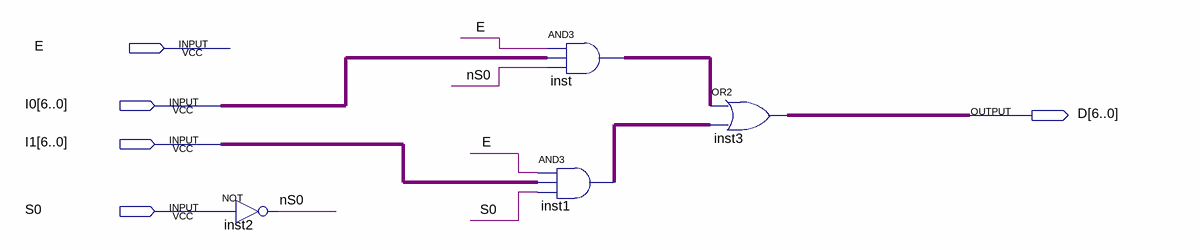
[diagram p0: schematic sheet]
// Quartus schematic MojMX2.bdf as structural Verilog: 4 symbols, 5 pins
module MojMX2 (
  input  E,
  input  [6:0] I0,
  input  [6:0] I1,
  input  S0,
  output [6:0] D
);

  wire nS0;
  wire [6:0] inst1_out, inst_out;

  not inst2 (nS0, S0);
  assign inst_out = {7{E}} & I0 & {7{nS0}};  // AND3 inst, 7 bits wide
  assign inst1_out = {7{E}} & I1 & {7{S0}};  // AND3 inst1, 7 bits wide
  assign D = inst_out | inst1_out;  // OR2 inst3, 7 bits wide
endmodule
